# Altium schematic sheet sister-board-SCHEMATIC.schdoc
size 134 x 146 mm
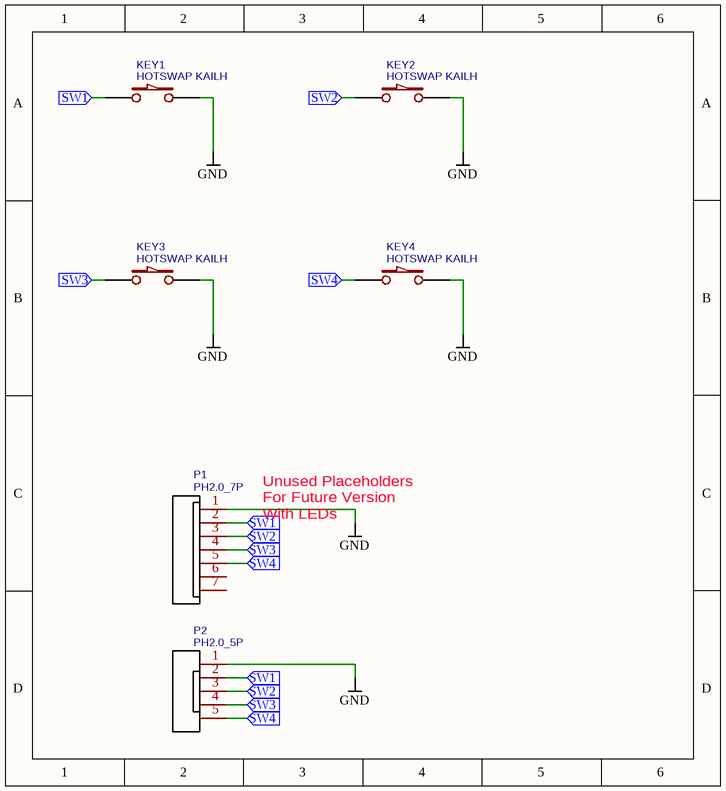
[diagram p0: sister-board-SCHEMATIC.schdoc]

## Parts
KEY1  HOTSWAP KAILH  [KAILH HOT SWAP]
KEY2  HOTSWAP KAILH  [KAILH HOT SWAP]
KEY3  HOTSWAP KAILH  [KAILH HOT SWAP]
KEY4  HOTSWAP KAILH  [KAILH HOT SWAP]
P1  PH2.0_7P  [PH2.0-7P-90-DIP]
P2  PH2.0_5P  [PH2.0_5P]

## Ports
SW1 (in), SW2 (in), SW3 (in), SW4 (in)

## Nets
GND: KEY1.2 KEY2.2 KEY3.2 KEY4.2 P1.1 P2.1
SW1: KEY1.1 P1.2 P2.2 ; port SW1
SW2: KEY2.1 P1.3 P2.3 ; port SW2
SW3: KEY3.1 P1.4 P2.4 ; port SW3
SW4: KEY4.1 P1.5 P2.5 ; port SW4

Not connected (* = marked no-connect by the designer): P1 6 7

## Notes on the sheet
- Unused Placeholders
  For Future Version
  With LEDs

## Library data of the parts
KEY1-KEY4 = HOTSWAP KAILH: Manufacturer: ReliaPro; Manufacturer Part: Switch3x4x2; Contributor: James Nixon; Supplier Part: C26638; spicePre: K; spiceSymbolName: HOTSWAP KAILH
P1 = PH2.0_7P: Manufacturer Part: New SchematicLib; Contributor: robellado; Package Display: No; spicePre: P; spiceSymbolName: PH2.0_7P
P2 = PH2.0_5P: Manufacturer Part: New SchematicLib; Contributor: oleg.evsegneev; spicePre: P; spiceSymbolName: PH2.0_5P